# Altium schematic sheet DISP_KEYB.SchDoc: Title
size 420 x 297 mm; Author: G.Kasprowicz; CompanyName: WUT ISE; DrawnBy: G.Kasprowicz; Organization: WUT ISE; Address1: PW ISE; Address2: Nowowiejska 15/19 00-665 Warsaw; Address3: gkasprow@gmail.com; Revision: 2; SheetNumber: 4; SheetTotal: 5; ModifiedBy: -; CheckedDate: -; Title2: Title 2; DivGrp: WUT ISE; Designer: G.Kasprowicz; ModifiedDate: -; ProjectName: Sensor Box
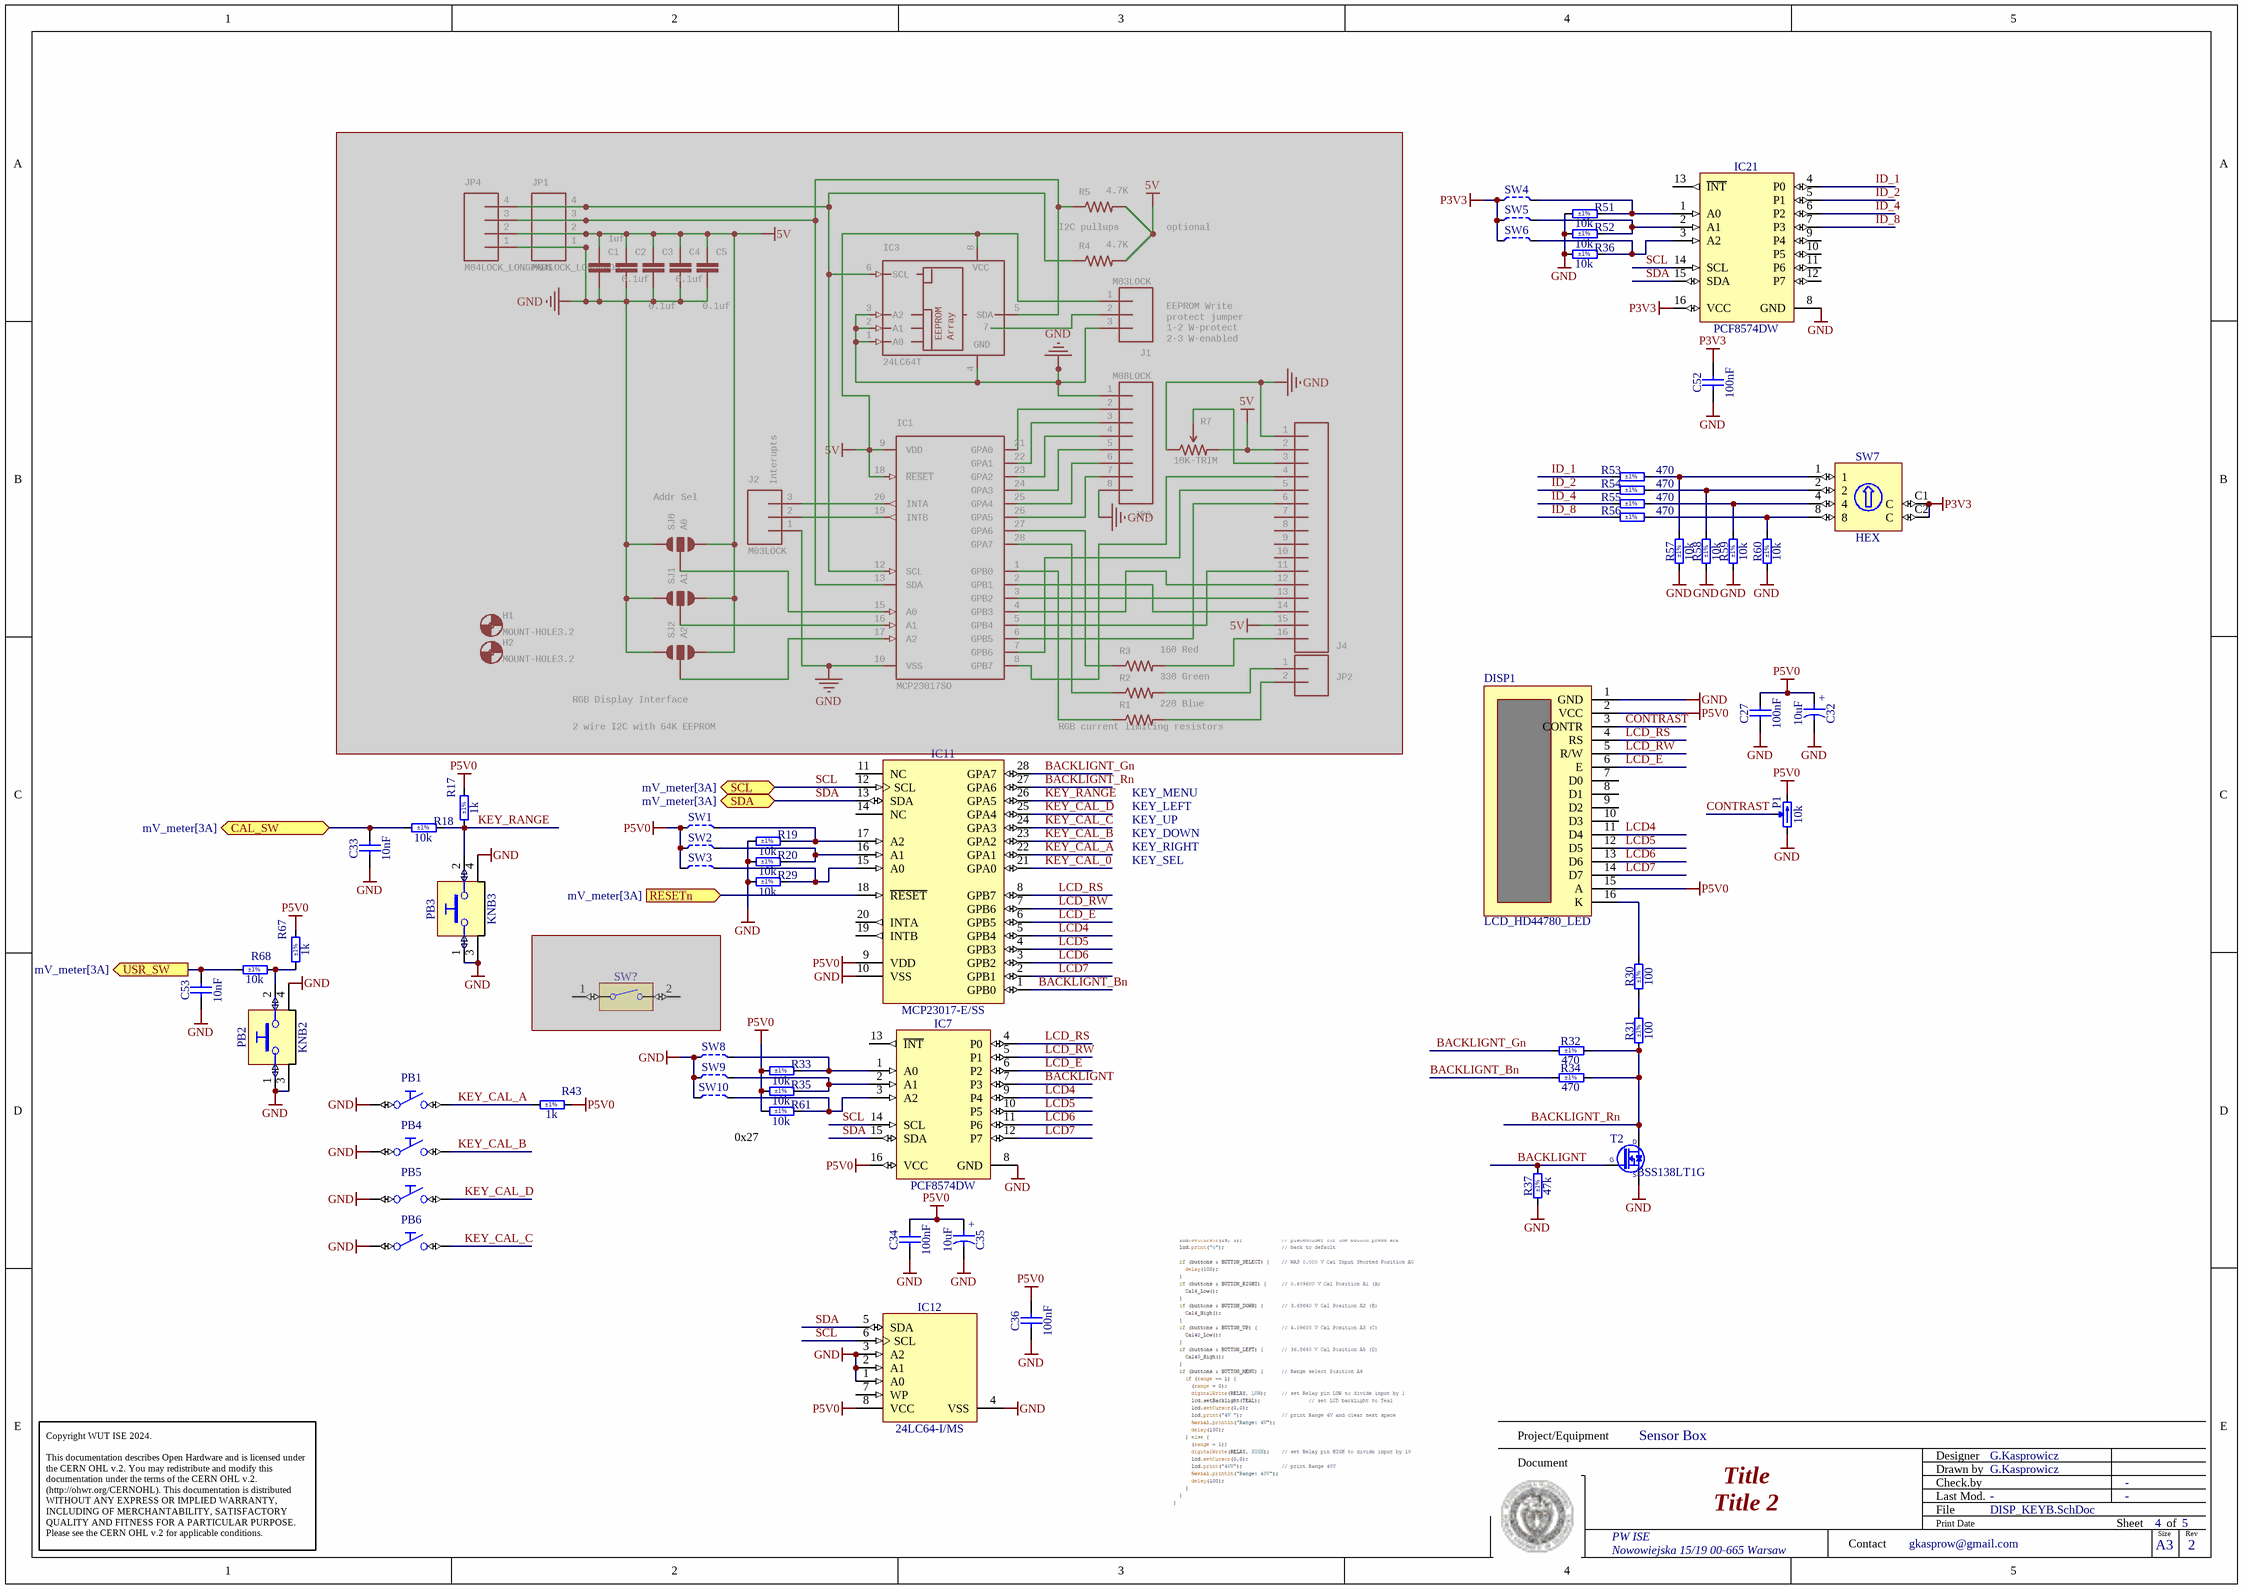
[diagram p0: DISP_KEYB.SchDoc]

## Parts
C1  1uf  [CAP-PTH-SMALLEZ]  (masked out: inside a compile mask, not in the netlist)
C2  0.1uf  [CAP-PTH-SMALLEZ]  (masked out: inside a compile mask, not in the netlist)
C3  0.1uf  [CAP-PTH-SMALLEZ]  (masked out: inside a compile mask, not in the netlist)
C4  0.1uf  [CAP-PTH-SMALLEZ]  (masked out: inside a compile mask, not in the netlist)
C5  0.1uf  [CAP-PTH-SMALLEZ]  (masked out: inside a compile mask, not in the netlist)
C27  100nF  [CAPC2012X88N]
C32  10uF  [CAPMP3216X180N]
C33  10nF  [CAPC1608X87N]
C34  100nF  [CAPC2012X88N]
C35  10uF  [CAPMP3216X180N]
C36  100nF  [CAPC2012X88N]
C52  100nF  [CAPC2012X88N]
C53  10nF  [CAPC1608X87N]
DISP1  LCD_HD44780_LED  [IDC_16_male]
H1  MOUNT-HOLE3.2  [3,2]  (masked out: inside a compile mask, not in the netlist)
H2  MOUNT-HOLE3.2  [3,2]  (masked out: inside a compile mask, not in the netlist)
IC1  MCP23017SO  [SO28W]  (masked out: inside a compile mask, not in the netlist)
IC3  24LC64T  [SO-08M]  (masked out: inside a compile mask, not in the netlist)
IC7  PCF8574DW  [SOIC127P1030X265-16N]
IC11  MCP23017-E/SS  [SOP65P780X200-28N]
IC12  24LC64-I/MS  [SOP65P490X110-8N]
IC21  PCF8574DW  [SOIC127P1030X265-16N]
J1  M03LOCK  [1X03_LOCK]  (masked out: inside a compile mask, not in the netlist)
J2  M03LOCK  [1X03_LOCK]  (masked out: inside a compile mask, not in the netlist)
J4  M16LOCK  [1X16_LOCK]  (value not drawn)  (masked out: inside a compile mask, not in the netlist)
JP1  M04LOCK_LONGPADS  [1X04_LOCK_LONGPADS]  (masked out: inside a compile mask, not in the netlist)
JP2  M02PTH  [1X02]  (value not drawn)  (masked out: inside a compile mask, not in the netlist)
JP3  M08LOCK  [1X08_LOCK]  (masked out: inside a compile mask, not in the netlist)
JP4  M04LOCK_LONGPADS  [1X04_LOCK_LONGPADS]  (masked out: inside a compile mask, not in the netlist)
KNB2  Knob  [KNB_OMRON_B32-2010_H]  (value not drawn)
KNB3  Knob  [KNB_OMRON_B32-2010_H]  (value not drawn)
P1  10k  [TRIM_BOURNS_3314G-1]
PB1  Push Button  [PB_C&K_KSS221GLFS]  (value not drawn)
PB2  Push Button  [PB_OMRON_B3F-3150]  (value not drawn)
PB3  Push Button  [PB_OMRON_B3F-3150]  (value not drawn)
PB4  Push Button  [PB_C&K_KSS221GLFS]  (value not drawn)
PB5  Push Button  [PB_C&K_KSS221GLFS]  (value not drawn)
PB6  Push Button  [PB_C&K_KSS221GLFS]  (value not drawn)
R1  220 Blue  [AXIAL-0.4]  (masked out: inside a compile mask, not in the netlist)
R2  330 Green  [AXIAL-0.4]  (masked out: inside a compile mask, not in the netlist)
R3  160 Red  [AXIAL-0.4]  (masked out: inside a compile mask, not in the netlist)
R4  4.7K  [AXIAL-0.3-KIT]  (masked out: inside a compile mask, not in the netlist)
R5  4.7K  [AXIAL-0.3-KIT]  (masked out: inside a compile mask, not in the netlist)
R7  10K-TRIM  [TRIMPOT_TC33]  (masked out: inside a compile mask, not in the netlist)
R17  1k  Tolerance: ±1%  [RESC1608X55N]
R18  10k  Tolerance: ±1%  [RESC1608X55N]
R19  10k  Tolerance: ±1%  [RESC1608X55N]
R20  10k  Tolerance: ±1%  [RESC1608X55N]
R29  10k  Tolerance: ±1%  [RESC1608X55N]
R30  100  Tolerance: ±1%  [RESC1608X55N]
R31  100  Tolerance: ±1%  [RESC1608X55N]
R32  470  Tolerance: ±1%  [RESC1608X55N]
R33  10k  Tolerance: ±1%  [RESC1608X55N]
R34  470  Tolerance: ±1%  [RESC1608X55N]
R35  10k  Tolerance: ±1%  [RESC1608X55N]
R36  10k  Tolerance: ±1%  [RESC1608X55N]
R37  47k  Tolerance: ±1%  [RESC1608X55N]
R43  1k  Tolerance: ±1%  [RESC1608X55N]
R51  10k  Tolerance: ±1%  [RESC1608X55N]
R52  10k  Tolerance: ±1%  [RESC1608X55N]
R53  470  Tolerance: ±1%  [RESC1608X55N]
R54  470  Tolerance: ±1%  [RESC1608X55N]
R55  470  Tolerance: ±1%  [RESC1608X55N]
R56  470  Tolerance: ±1%  [RESC1608X55N]
R57  10k  Tolerance: ±1%  [RESC1608X55N]
R58  10k  Tolerance: ±1%  [RESC1608X55N]
R59  10k  Tolerance: ±1%  [RESC1608X55N]
R60  10k  Tolerance: ±1%  [RESC1608X55N]
R61  10k  Tolerance: ±1%  [RESC1608X55N]
R67  1k  Tolerance: ±1%  [RESC1608X55N]
R68  10k  Tolerance: ±1%  [RESC1608X55N]
SJ0  A0  [SJ_3_PASTE2&3]  (masked out: inside a compile mask, not in the netlist)
SJ1  A1  [SJ_3_PASTE2&3]  (masked out: inside a compile mask, not in the netlist)
SJ2  A2  [SJ_3_PASTE2&3]  (masked out: inside a compile mask, not in the netlist)
SW1  Switch  [JUMPSMD0805_G50]  (value not drawn)  (no BOM)
SW2  Switch  [JUMPSMD0805_G50]  (value not drawn)  (no BOM)
SW3  Switch  [JUMPSMD0805_G50]  (value not drawn)  (no BOM)
SW4  Switch  [JUMPSMD0805_G50]  (value not drawn)  (no BOM)
SW5  Switch  [JUMPSMD0805_G50]  (value not drawn)  (no BOM)
SW6  Switch  [JUMPSMD0805_G50]  (value not drawn)  (no BOM)
SW7  HEX  [SW_APEM_PT65106L254]
SW8  Switch  [JUMPSMD0805_G50]  (value not drawn)  (no BOM)
SW9  Switch  [JUMPSMD0805_G50]  (value not drawn)  (no BOM)
SW10  Switch  [JUMPSMD0805_G50]  (value not drawn)  (no BOM)
SW?  Switch  [SW_OMRON_B3U-3000PM]  (value not drawn)  (masked out: inside a compile mask, not in the netlist)
T2  BSS138LT1G  [SOT95P240X110-3N]

## Ports
CAL_SW (bidir, see mV_meter[3A]), RESETn (in, see mV_meter[3A]), SCL (bidir, see mV_meter[3A]), SDA (bidir, see mV_meter[3A]), USR_SW (out, see mV_meter[3A])

## Nets
GND: C27.1 C32.2 C33.1 C34.1 C35.2 C36.1 C52.1 C53.1 DISP1.1(GND) IC7.8(GND) IC11.10(VSS) IC12.1(A0) IC12.2(A1) IC12.3(A2) IC12.4(VSS) IC21.8(GND) P1.1(CCW) PB1.1(C) PB2.1 PB2.3 PB2.4 PB3.1 PB3.3 PB3.4 PB4.1(C) PB5.1(C) PB6.1(C) R19.1 R20.1 R29.1 R36.1 R37.1 R51.1 R52.1 R57.1 R58.1 R59.1 R60.1 SW8.1 SW9.1 SW10.1 T2.2(S)
P3V3: C52.2 IC21.16(VCC) SW4.1 SW5.1 SW6.1 SW7.C1(C) SW7.C2(C)
P5V0: C27.2 C32.1 C34.2 C35.1 C36.2 DISP1.2(VCC) DISP1.15(A) IC7.16(VCC) IC11.9(VDD) IC12.8(VCC) P1.3(CW) R17.2 R33.1 R35.1 R43.2 R61.1 R67.2 SW1.1 SW2.1 SW3.1
BACKLIGNT: IC7.7(P3) R37.2 T2.1(G)
BACKLIGNT_Bn: IC11.1(GPB0) R34.1
BACKLIGNT_Gn: IC11.28(GPA7) R32.1
BACKLIGNT_Rn: IC11.27(GPA6) R31.1 R32.2 R34.2 T2.3(D)
CAL_SW: C33.2 R18.1 ; port CAL_SW
CONTRAST: DISP1.3(CONTR) P1.2(W)
ID_1: IC21.4(P0) R53.1
ID_2: IC21.5(P1) R54.1
ID_4: IC21.6(P2) R55.1
ID_8: IC21.7(P3) R56.1
KEY_CAL_0: IC11.21(GPA0)
KEY_CAL_A: IC11.22(GPA1) PB1.2(NO) R43.1
KEY_CAL_B: IC11.23(GPA2) PB4.2(NO)
KEY_CAL_C: IC11.24(GPA3) PB6.2(NO)
KEY_CAL_D: IC11.25(GPA4) PB5.2(NO)
KEY_RANGE: IC11.26(GPA5) PB3.2 R17.1 R18.2
LCD4: DISP1.11(D4) IC7.9(P4) IC11.5(GPB4)
LCD5: DISP1.12(D5) IC7.10(P5) IC11.4(GPB3)
LCD6: DISP1.13(D6) IC7.11(P6) IC11.3(GPB2)
LCD7: DISP1.14(D7) IC7.12(P7) IC11.2(GPB1)
LCD_E: DISP1.6(E) IC7.6(P2) IC11.6(GPB5)
LCD_RS: DISP1.4(RS) IC7.4(P0) IC11.8(GPB7)
LCD_RW: DISP1.5(R/W) IC7.5(P1) IC11.7(GPB6)
RESETn: IC11.18(~{RESET}) ; port RESETn
SCL: IC7.14(SCL) IC11.12(SCL) IC12.6(SCL) IC21.14(SCL) ; port SCL
SDA: IC7.15(SDA) IC11.13(SDA) IC12.5(SDA) IC21.15(SDA) ; port SDA
USR_SW: C53.2 R68.1 ; port USR_SW
NetDISP1_16: DISP1.16(K) R30.2
NetIC7_1: IC7.1(A0) R33.2 SW8.2
NetIC7_2: IC7.2(A1) R35.2 SW9.2
NetIC7_3: IC7.3(A2) R61.2 SW10.2
NetIC11_15: IC11.15(A0) R29.2 SW3.2
NetIC11_16: IC11.16(A1) R20.2 SW2.2
NetIC11_17: IC11.17(A2) R19.2 SW1.2
NetIC21_1: IC21.1(A0) R51.2 SW4.2
NetIC21_2: IC21.2(A1) R52.2 SW5.2
NetIC21_3: IC21.3(A2) R36.2 SW6.2
NetPB2_2: PB2.2 R67.1 R68.2
NetR30_1: R30.1 R31.2
NetR53_2: R53.2 R57.2 SW7.1
NetR54_2: R54.2 R58.2 SW7.2
NetR55_2: R55.2 R59.2 SW7.4
NetR56_2: R56.2 R60.2 SW7.8

Not connected (* = marked no-connect by the designer): DISP1 7(D0) 8(D1) 9(D2) 10(D3); IC7 13(~{INT}); IC11 11(NC) 14(NC) 19(INTB) 20(INTA); IC12 7(WP); IC21 9(P4) 10(P5) 11(P6) 12(P7) 13(~{INT})

## Notes on the sheet
- I2C pullups
- optional
- (near IC3) 7
- (near J1) EEPROM Write
  protect jumper
  1-2 W-protect
  2-3 W-enabled
- (near SJ0) Addr Sel
- (near J2) Interupts
- (near SJ2) RGB Display Interface
- 2 wire I2C with 64K EEPROM
- (near R1) RGB current limiting resistors
- KEY_MENU
- KEY_LEFT
- KEY_UP
- KEY_DOWN
- KEY_RIGHT
- KEY_SEL
- 0x27
- Project/Equipment
- Document
- Designer
- Drawn by
- Check.by
- Copyright WUT ISE 2024.
  This documentation describes Open Hardware and is licensed under the CERN OHL v.2. You may redistribute and modify this documentation under the terms of the CERN OHL v.2. (http://ohwr.org/CERNOHL). This documentation is distributed WITHOUT ANY EXPRESS OR IMPLIED WARRANTY, INCLUDING OF MERCHANTABILITY, SATISFACTORY QUALITY AND FITNESS FOR A PARTICULAR PURPOSE. Please see the CERN OHL v.2 for applicable conditions.
- Contact
- File
- Last Mod.
- Print Date
- Sheet
- Size
- A3
- of
- Rev
- (in symbol CTE3216-18_10UF_10V_10%_LESR1800) +

## Library data of the parts
C1-C5 = CAPEZ: CapacitorStandard 0603 ceramic capacitor, and 0.1" leaded capacitor.; GateName_1: G$1; SymbolName_1: CAP; DeviceName: EZ; LibraryName: SparkFun-Capacitors; DeviceSetName: CAP
C27 C34 C36 C52 = CC0805_100NF_50V_1%_NP0: Non-polarised capacitor; Part Description: SMD Multilayer Chip Ceramic Capacitor; Manufacturer: GENERIC; Manufacturer1 Part Number: 0805N103F500C; Voltage: 50V; TC: C0G/NP0; Tolerance: ±1%; Part Number: CC0805_100NF_50V_1%_NP0; Component Kind: Standard; Component Type: Standard; Footprint: CAPC2012X135N; Pin Count: 2; Value: 100nF; Status: Not Recommended; Manufacturer Part Number: CC0805_100NF_50V_1%_NP0; Case: 0805; Mounted: Yes; Socket: No; SMD: Yes; Sense: No; ComponentHeight: 1.35mm; Manufacturer1 Example: WALSIN TECHNOLOGY CORPORATION; Manufacturer1 ComponentHeight: 1.35mm; HelpURL: \\cern.ch\dfs\Applications\Altium\Datasheets\CC0805_WALSIN_0805.pdf; Author: CERN DEM HF; CreateDate: 28.08.2023; LatestRevisionDate: 28.08.2023
C32 C35 = CTE3216-18_10UF_10V_10%_LESR1800: Polarised capacitor; Part Description: Low ESR 1R8 Solid Tantalum Chip Capacitor; Manufacturer: GENERIC; Manufacturer1 Part Number: TPSA106K010R1800; Voltage: 10V; Tolerance: ±10%; Part Number: CTE3216-18_10UF_10V_10%_LESR1800; Component Kind: Standard; Component Type: Standard; Pin Count: 2; Value: 10uF; Status: Preferred; Manufacturer Part Number: CTE3216-18_10UF_10V_10%_LESR1800; Case: A; Mounted: Yes; Socket: No; SMD: Yes; Sense: No; Manufacturer1 Example: AVX; Manufacturer1 ComponentHeight: 1.8mm; HelpURL: \\cern.ch\dfs\Applications\Altium\Datasheets\CTE-LESR_AVX_TPS.pdf; Author: CERN DEM JLC; CreateDate: 05.05.2008; LatestRevisionDate: 20.01.2009
C33 C53 = CC0603_10NF_50V_5%_C0G: Non-polarised capacitor; Part Description: SMD Multilayer Chip Ceramic Capacitor; Manufacturer: GENERIC; Manufacturer1 Part Number: C1608C0G1H103J080; Voltage: 50V; TC: C0G/NP0; Tolerance: ±5%; Part Number: CC0603_10NF_50V_5%_C0G; Component Kind: Standard; Component Type: Standard; Pin Count: 2; Value: 10nF; Status: Preferred; Manufacturer Part Number: CC0603_10NF_50V_5%_C0G; Case: 0603; Mounted: Yes; Socket: No; SMD: Yes; Sense: No; Manufacturer1 Example: TDK; Manufacturer1 ComponentHeight: 0.9mm; HelpURL: \\cern.ch\dfs\Applications\Altium\Datasheets\CC0603_C0G_TDK_C.pdf; Author: CERN DEM JLC; CreateDate: 10.12.2014; LatestRevisionDate: 10.12.2014
DISP1 = LCD_HD44780_LED: LCD character display socket with backlight
H1 H2 = MOUNT-HOLE3.2: MOUNTING HOLE with drill center marker; GateName_1: G$1; DeviceName: 3.2; SymbolName_1: MOUNT-HOLE; LibraryName: holes; DeviceSetName: MOUNT-HOLE
IC1 = MCP23017SO: http://ww1.microchip.com/downloads/en/DeviceDoc/21952a.pdf   Source: http://ww1.microchip.com/downloads/en/DeviceDoc/21952a.pdf; GateName_1: G$1; DeviceName: SO; SymbolName_1: MCP23017; LibraryName: adafruit; DeviceSetName: MCP23017
IC3 = 24-*SM: Serial EEPROM   32 K/64 K, 1.8 V, I2C; MPN: 24LC65/SM; GateName_1: G$1; SymbolName_1: 24AA32; DeviceName: SM; DeviceSetName: 24-*; MF: MICROCHIP; LibraryName: microchip; Array: Array; VCC: VCC; GND: GND; EEPROM: EEPROM; OC_FARNELL: 9758097; OC_NEWARK: 96K4082
IC7 IC21 = PCF8574DW: Remote 8-bit I/O Expander For I2C Bus; Manufacturer: TEXAS INSTRUMENTS; PressFit: No; Bonding: No; Part Number: PCF8574DW; Component Kind: Standard; Component Type: Standard; Device: PCF8574DW; PackageDescription: SOIC, 1.27mm Pitch; 16 Pin, 7.50mm W X 10.3mm L X 2.65mm H body, IPC Medium Density; Part Description: Remote 8-bit I/O Expander for I2C Bus; Manufacturer Part Number: PCF8574DW; Pin Count: 16; Case: SOIC16W; Mounted: Yes; Socket: No; SMD: Yes; Sense: No; ComponentHeight: 2.65mm; Author: CERN DEM JLC; HelpURL: \\cern.ch\dfs\Applications\Altium\Datasheets\PCF8574DW.pdf; CreateDate: 25.08.2011; LatestRevisionDate: 25.08.2011
IC11 = MCP23017-E/SS: 16-bit I/O Port Expander With Serial Interface; Manufacturer: MICROCHIP TECHNOLOGY; PressFit: No; Bonding: No; Part Number: MCP23017-E/SS; Component Kind: Standard; Component Type: Standard; Device: MCP23017-E/SS; PackageDescription: SOP, 0.65mm Pitch; 28 Pin, 5.30mm W X 10.20mm L X 2.00mm H Body, IPC Medium Density; Part Description: 16-bit I/O Port Expander with Serial Interface; Manufacturer Part Number: MCP23017-E/SS; Pin Count: 28; Case: SSOP28; Mounted: Yes; Socket: No; SMD: Yes; Sense: No; ComponentHeight: 2mm; Author: CERN DEM JLC; HelpURL: \\cern.ch\dfs\Applications\Altium\Datasheets\MCP23017-E-SS.pdf; CreateDate: 17.01.2011; LatestRevisionDate: 17.01.2011
IC12 = 24LC64-I/MS: 64K I2C Serial EEPROM; Part Description: 2.5V-5.5V, 64K (8K x 8-bit) I2C Serial EEPROM; Manufacturer: MICROCHIP TECHNOLOGY; PressFit: No; Bonding: No; Part Number: 24LC64-I/MS; Component Kind: Standard; Component Type: Standard; Device: 24LC64-I/MS; PackageDescription: SOP, 0.65mm pitch; 8 pin, 3.00mm W X 3.00mm L X 1.10mm H body, IPC Medium Density; Manufacturer Part Number: 24LC64-I/MS; Pin Count: 8; Case: MSOP8; Mounted: Yes; Socket: No; SMD: Yes; Sense: No; ComponentHeight: 1.1mm; HelpURL: \\cern.ch\dfs\Applications\Altium\Datasheets\24LC64-I-MS.pdf; Author: CERN DEM JLC; CreateDate: 24.01.2011; LatestRevisionDate: 24.01.2011
J1 J2 = M03LOCK: Header 3Standard 3-pin 0.1" header. Use with straight break away headers (SKU : PRT-00116), right angle break away headers (PRT-00553), swiss pins (PRT-00743), machine pins (PRT-00117), and female headers (PRT-00115). Molex polarized connector foot print use with SKU : PRT-08232 with associated crimp pins and housings.; GateName_1: J$1; SymbolName_1: M03; DeviceName: LOCK; LibraryName: SparkFun-Connectors; DeviceSetName: M03
J4 = M16LOCK: 1x16 .1" header; GateName_1: G$1; SymbolName_1: M16; DeviceName: LOCK; LibraryName: SparkFun-Connectors; DeviceSetName: M16
JP1 JP4 = M04LOCK_LONGPADS: Header 4Standard 4-pin 0.1" header. Use with straight break away headers (SKU : PRT-00116), right angle break away headers (PRT-00553), swiss pins (PRT-00743), machine pins (PRT-00117), and female headers (PRT-00115). Molex polarized connector foot print use with SKU : PRT-08231 with associated crimp pins and housings. 1MM SMD Version SKU: PRT-10208; GateName_1: G$1; SymbolName_1: M04; DeviceName: LOCK_LONGPADS; LibraryName: SparkFun-Connectors; DeviceSetName: M04
JP2 = M02PTH: Standard 2-pin 0.1" header. Use with  - straight break away headers ( PRT-00116) - right angle break away headers (PRT-00553) - swiss pins (PRT-00743) - machine pins (PRT-00117) - female headers (PRT-00115)   Molex polarized connector foot print use with: PRT-08233 with associated crimp pins and housings.  2.54_SCREWTERM for use with  PRT-10571.  3.5mm Screw Terminal footprints for  PRT-08084  5mm Screw Terminal footprints for use with PRT-08432; GateName_1: G$1; SymbolName_1: M02; DeviceName: PTH; LibraryName: SparkFun-Connectors; DeviceSetName: M02
JP3 = M08LOCK: Header 8Standard 8-pin 0.1" header. Use with straight break away headers (SKU : PRT-00116), right angle break away headers (PRT-00553), swiss pins (PRT-00743), machine pins (PRT-00117), and female headers (PRT-00115).; GateName_1: G$1; SymbolName_1: M08; DeviceName: LOCK; LibraryName: SparkFun-Connectors; DeviceSetName: M08
KNB2 KNB3 = KNB_OMRON_B32-2010_h: Knob For Push-Button Switch OMRON SERIE B32; Part Description: Black Knob For OMRON Push-Button Switch (Dia. 6mm L=5.5mm); PressFit: No; Part Number: KNB_OMRON_B32-2010_h; Component Kind: Accessories; Component Type: Mechanical; Pin Count: 0; PackageDescription: Black Knob For OMRON Push-Button Switch (Dia. 6mm L=5.5mm) Horizontal; Family: Knob; Mounted: Yes; Socket: No; SMD: No; Sense: No; Status: None; Manufacturer: OMRON; Manufacturer Part Number: B32-2010; ComponentHeight: 7mm; HelpURL: \\cern.ch\dfs\Applications\Altium\Datasheets\KNB_OMRON_B32-2010.pdf; Author: CERN DEM HF; CreateDate: 13.05.2022; LatestRevisionDate: 13.05.2022
P1 = TRIM_1T_10K_BOURNS_3314G-1-103E: Trimming Potentiometer; Part Description: Single Turn 4mm Square Trimpot® Trimming Potentiometer (Top Adjust); Manufacturer: BOURNS; Power: 0.25W; TC: ±100ppm/°C; Tolerance: ±20%; PressFit: No; Part Number: TRIM_1T_10K_BOURNS_3314G-1-103E; Component Kind: Standard; Component Type: Standard; Pin Count: 3; Value: 10k; Manufacturer Part Number: 3314G-1-103E; Case: 3314G-1; Mounted: Yes; Socket: No; SMD: Yes; Sense: No; ComponentHeight: 2.55mm; HelpURL: \\cern.ch\dfs\Applications\Altium\Datasheets\TRIM_BOURNS_3314G-1.pdf; Author: CERN DEM JLC; CreateDate: 04.03.2014; LatestRevisionDate: 04.03.2014
PB1 PB4-PB6 = PB_C&K_KSS221GLFS: Push-Button Switch SPST; Part Description: 32VDC 50mA SPST-NO Surface Mount Subminiature Tact Momentary Side Actuated Pushbutton Switch, Operating Force 2N; Manufacturer: C&K; PressFit: No; Sense Comment: Non-washable; Part Number: PB_C&K_KSS221GLFS; Component Kind: Standard; Component Type: Standard; Pin Count: 2; PackageDescription: Body 7.0x3.5mm, Surface Mount Subminiature Tact Side Actuated Switch, C&K KSS Series; Family: Push Button; Mounted: Yes; Socket: No; SMD: Yes; Sense: Yes; Status: None; Manufacturer Part Number: KSS221GLFS; ComponentHeight: 1.7mm; HelpURL: \\cern.ch\dfs\Applications\Altium\Datasheets\PB_C&K_KSS221GLFS.pdf; Author: CERN DEM BC; CreateDate: 02.12.2019; LatestRevisionDate: 02.12.2019
PB2 PB3 = PB_OMRON_B3F-3150: Push-Button Switch SPST; Part Description: 24VDC 50mA SPST-NO Tactile Push-Button Switch, Side-operated (h=7.4mm); Manufacturer: OMRON; PressFit: No; Part Number: PB_OMRON_B3F-3150; Component Kind: Standard; Component Type: Standard; Pin Count: 4; PackageDescription: 7.3x6.25mm Model, Side-operated , Projected Plunger Type (without Ground Terminal) Pushbutton Switch, OMRON B3F Series; Family: Push Button; Mounted: Yes; Socket: No; SMD: No; Sense: No; Status: None; Manufacturer Part Number: B3F-3150; ComponentHeight: 7.4mm; HelpURL: \\cern.ch\dfs\Applications\Altium\Datasheets\PB_OMRON_B3F-3150.pdf; Author: CERN DEM HF; CreateDate: 13.05.2022; LatestRevisionDate: 13.05.2022
R1-R3 = RESISTORPTH-1/4W: ResistorBasic schematic elements and footprints for 0603, 1206, and PTH resistors.; GateName_1: G$1; SymbolName_1: RESISTOR; DeviceName: PTH-1/4W; LibraryName: SparkFun-Resistors; DeviceSetName: RESISTOR
R4 R5 = RESISTORKIT: ResistorBasic schematic elements and footprints for 0603, 1206, and PTH resistors.; GateName_1: G$1; DeviceName: KIT; SymbolName_1: RESISTOR; LibraryName: SparkFun-Resistors; DeviceSetName: RESISTOR
R7 = TRIMPOT-2: Various small potentiometers for "set-and-forget" applications; GateName_1: R?; SymbolName_1: TRIMPOT-1; DeviceName: -2; LibraryName: SparkFun-Electromechanical; DeviceSetName: TRIMPOT
R17 R43 R67 = R0603_1K_1%_0.1W_100PPM: Resistor - 1%; Part Description: General Purpose Thick Film Chip Resistor; Manufacturer: GENERIC; Manufacturer1 Part Number: NRC06F1001TRF; Power: 0.1W; TC: ±100ppm/°C; PressFit: No; Part Number: R0603_1K_1%_0.1W_100PPM; Component Kind: Standard; Component Type: Standard; Pin Count: 2; Value: 1k; Status: Preferred; Manufacturer Part Number: R0603_1K_1%_0.1W_100PPM; Case: 0603; Mounted: Yes; Sense: No; Socket: No; SMD: Yes; Manufacturer1 Example: NIC COMPONENT; Manufacturer1 ComponentHeight: 0.55mm; HelpURL: \\cern.ch\dfs\Applications\Altium\Datasheets\R0603_NIC_NRC.pdf; Author: CERN DEM JLC; CreateDate: 03.12.2007; LatestRevisionDate: 13.03.2008
R18-R20 R29 R33 R35 R36 R51 R52 R57-R61 R68 = R0603_10K_1%_0.1W_100PPM: Resistor - 1%; Part Description: General Purpose Thick Film Chip Resistor; Manufacturer: GENERIC; Manufacturer1 Part Number: NRC06F1002TRF; Power: 0.1W; TC: ±100ppm/°C; PressFit: No; Part Number: R0603_10K_1%_0.1W_100PPM; Component Kind: Standard; Component Type: Standard; Pin Count: 2; Value: 10k; Status: Preferred; Manufacturer Part Number: R0603_10K_1%_0.1W_100PPM; Case: 0603; Mounted: Yes; Sense: No; Socket: No; SMD: Yes; Manufacturer1 Example: NIC COMPONENT; Manufacturer1 ComponentHeight: 0.55mm; HelpURL: \\cern.ch\dfs\Applications\Altium\Datasheets\R0603_NIC_NRC.pdf; Author: CERN DEM JLC; CreateDate: 03.12.2007; LatestRevisionDate: 13.03.2008
R30 R31 = R0603_100R_1%_0.1W_100PPM: Resistor - 1%; Part Description: General Purpose Thick Film Chip Resistor; Manufacturer: GENERIC; Manufacturer1 Part Number: NRC06F4700TRF; Power: 0.1W; TC: ±100ppm/°C; PressFit: No; Part Number: R0603_100R_1%_0.1W_100PPM; Component Kind: Standard; Component Type: Standard; Pin Count: 2; Value: 100; Status: Preferred; Manufacturer Part Number: R0603_100R_1%_0.1W_100PPM; Case: 0603; Mounted: Yes; Sense: No; Socket: No; SMD: Yes; Manufacturer1 Example: NIC COMPONENT; Manufacturer1 ComponentHeight: 0.55mm; HelpURL: \\cern.ch\dfs\Applications\Altium\Datasheets\R0603_NIC_NRC.pdf; Author: CERN DEM JLC; CreateDate: 03.12.2007; LatestRevisionDate: 13.03.2008
R32 R34 R53-R56 = R0603_470R_1%_0.1W_100PPM: Resistor - 1%; Part Description: General Purpose Thick Film Chip Resistor; Manufacturer: GENERIC; Manufacturer1 Part Number: NRC06F4700TRF; Power: 0.1W; TC: ±100ppm/°C; PressFit: No; Part Number: R0603_470R_1%_0.1W_100PPM; Component Kind: Standard; Component Type: Standard; Pin Count: 2; Value: 470; Status: Preferred; Manufacturer Part Number: R0603_470R_1%_0.1W_100PPM; Case: 0603; Mounted: Yes; Sense: No; Socket: No; SMD: Yes; Manufacturer1 Example: NIC COMPONENT; Manufacturer1 ComponentHeight: 0.55mm; HelpURL: \\cern.ch\dfs\Applications\Altium\Datasheets\R0603_NIC_NRC.pdf; Author: CERN DEM JLC; CreateDate: 03.12.2007; LatestRevisionDate: 13.03.2008
R37 = R0603_47K_1%_0.1W_100PPM: Resistor - 1%; Part Description: General Purpose Thick Film Chip Resistor; Manufacturer: GENERIC; Manufacturer1 Part Number: NRC06F4702TRF; Power: 0.1W; TC: ±100ppm/°C; PressFit: No; Part Number: R0603_47K_1%_0.1W_100PPM; Component Kind: Standard; Component Type: Standard; Pin Count: 2; Value: 47k; Status: Preferred; Manufacturer Part Number: R0603_47K_1%_0.1W_100PPM; Case: 0603; Mounted: Yes; Sense: No; Socket: No; SMD: Yes; Manufacturer1 Example: NIC COMPONENT; Manufacturer1 ComponentHeight: 0.55mm; HelpURL: \\cern.ch\dfs\Applications\Altium\Datasheets\R0603_NIC_NRC.pdf; Author: CERN DEM JLC; CreateDate: 03.12.2007; LatestRevisionDate: 13.03.2008
SJ0-SJ2 = SOLDERJUMPER_2WAYPASTE2&3: Solder Jumper2 way solder jumper; GateName_1: G$1; SymbolName_1: SJ_2; DeviceName: PASTE2&3; LibraryName: SparkFun-Passives; DeviceSetName: SOLDERJUMPER_2WAY
SW1-SW6 SW8-SW10 = JUMPSMD0805_G50: 2 SMD Pads for Bound by Solder  Drop; Part Description: 2 SMD Pads for Bound by Solder Drop - Equivalent Size 0805 - Gap 0.5mm; Manufacturer: None; Mounted: No; PressFit: No; Part Number: JUMPSMD0805_G50; Component Type: Standard (No BOM); Pin Count: 2; PackageDescription: 2 SMD Pads for Bound by Solder Drop - Equivalent Size 0805 - Gap 0.5mm; Family: Switch; Socket: No; SMD: No; Sense: No; Status: None; Manufacturer Part Number: None; ComponentHeight: 0mm; HelpURL: None; Author: CERN DEM JLC; CreateDate: 26.08.2009; LatestRevisionDate: 12.02.2021
SW7 = SW_APEM_PT65106L254: Rotary Code Switch 1 2 4 8 C1 C2; Part Description: Rotary Hexadecimal Right Angled Switch, Screwdriver Actuator, Straight terminals; Manufacturer: APEM; PressFit: No; Part Number: SW_APEM_PT65106L254; Component Kind: Standard; Component Type: Standard; Pin Count: 6; PackageDescription: Body 10x10mm, Right Angled Rotary Hexadecimal Code Switch With Screwdriver Actuator, APEM PT65 (CR65) Series; Family: HEX; Mounted: Yes; Socket: No; SMD: No; Sense: No; Status: None; Manufacturer Part Number: PT65106L254; ComponentHeight: 10mm; HelpURL: \\cern.ch\dfs\Applications\Altium\Datasheets\SW_APEM_PT65106L254.pdf; Author: CERN DEM JLC; CreateDate: 18.06.2014; LatestRevisionDate: 18.06.2014
SW? = SW_OMRON_B3U-3000PM: 1 Ways SPST DIP Switch; Part Description: Ultra-small Surface-mounting Tactile Switche with High Contact Reliability, Side-actuated, Contact Rating 50mA 12VDC; Manufacturer: OMRON; PressFit: No; Sense Comment: Non-washable; Part Number: SW_OMRON_B3U-3000PM; Component Kind: Standard; Component Type: Standard; Pin Count: 2; PackageDescription: Body 3.2x4.0mm, SPST Surface-Mounting Tactile Switch with Side Actuator (B3U Series); Family: Switch; Mounted: Yes; Socket: No; SMD: Yes; Sense: Yes; Status: None; Manufacturer Part Number: B3U-3000PM; ComponentHeight: 1.35mm; HelpURL: \\cern.ch\dfs\Applications\Altium\Datasheets\SW_OMRON_B3U.pdf; Author: CERN DEM HF; CreateDate: 04.10.2022; LatestRevisionDate: 04.10.2022
T2 = BSS138LT1G: N-CHANNEL MOSFET WITH DIODE; Part Description: 50V, 200mA N-Channel Enhancement Mode Field-Effect Transistor; Manufacturer: ON SEMICONDUCTOR; PressFit: No; Bonding: No; Part Number: BSS138LT1G; Component Kind: Standard; Component Type: Standard; Device: BSS138LT1G; PackageDescription: SOT23, 0.95mm Pitch; 3 Pin, 1.40mm W X 3.00mm L X 1.10mm H body, IPC Medium Density; Manufacturer Part Number: BSS138L; Pin Count: 3; Case: SOT23-3; Mounted: Yes; Socket: No; SMD: Yes; Sense: No; ComponentHeight: 1.11mm; HelpURL: \\cern.ch\dfs\Applications\Altium\Datasheets\BSS138LT1G.pdf; Author: CERN DEM JLC; CreateDate: 23.03.2009; LatestRevisionDate: 25.05.2022